# EAGLE design RS422 (EAGLE 5.05)
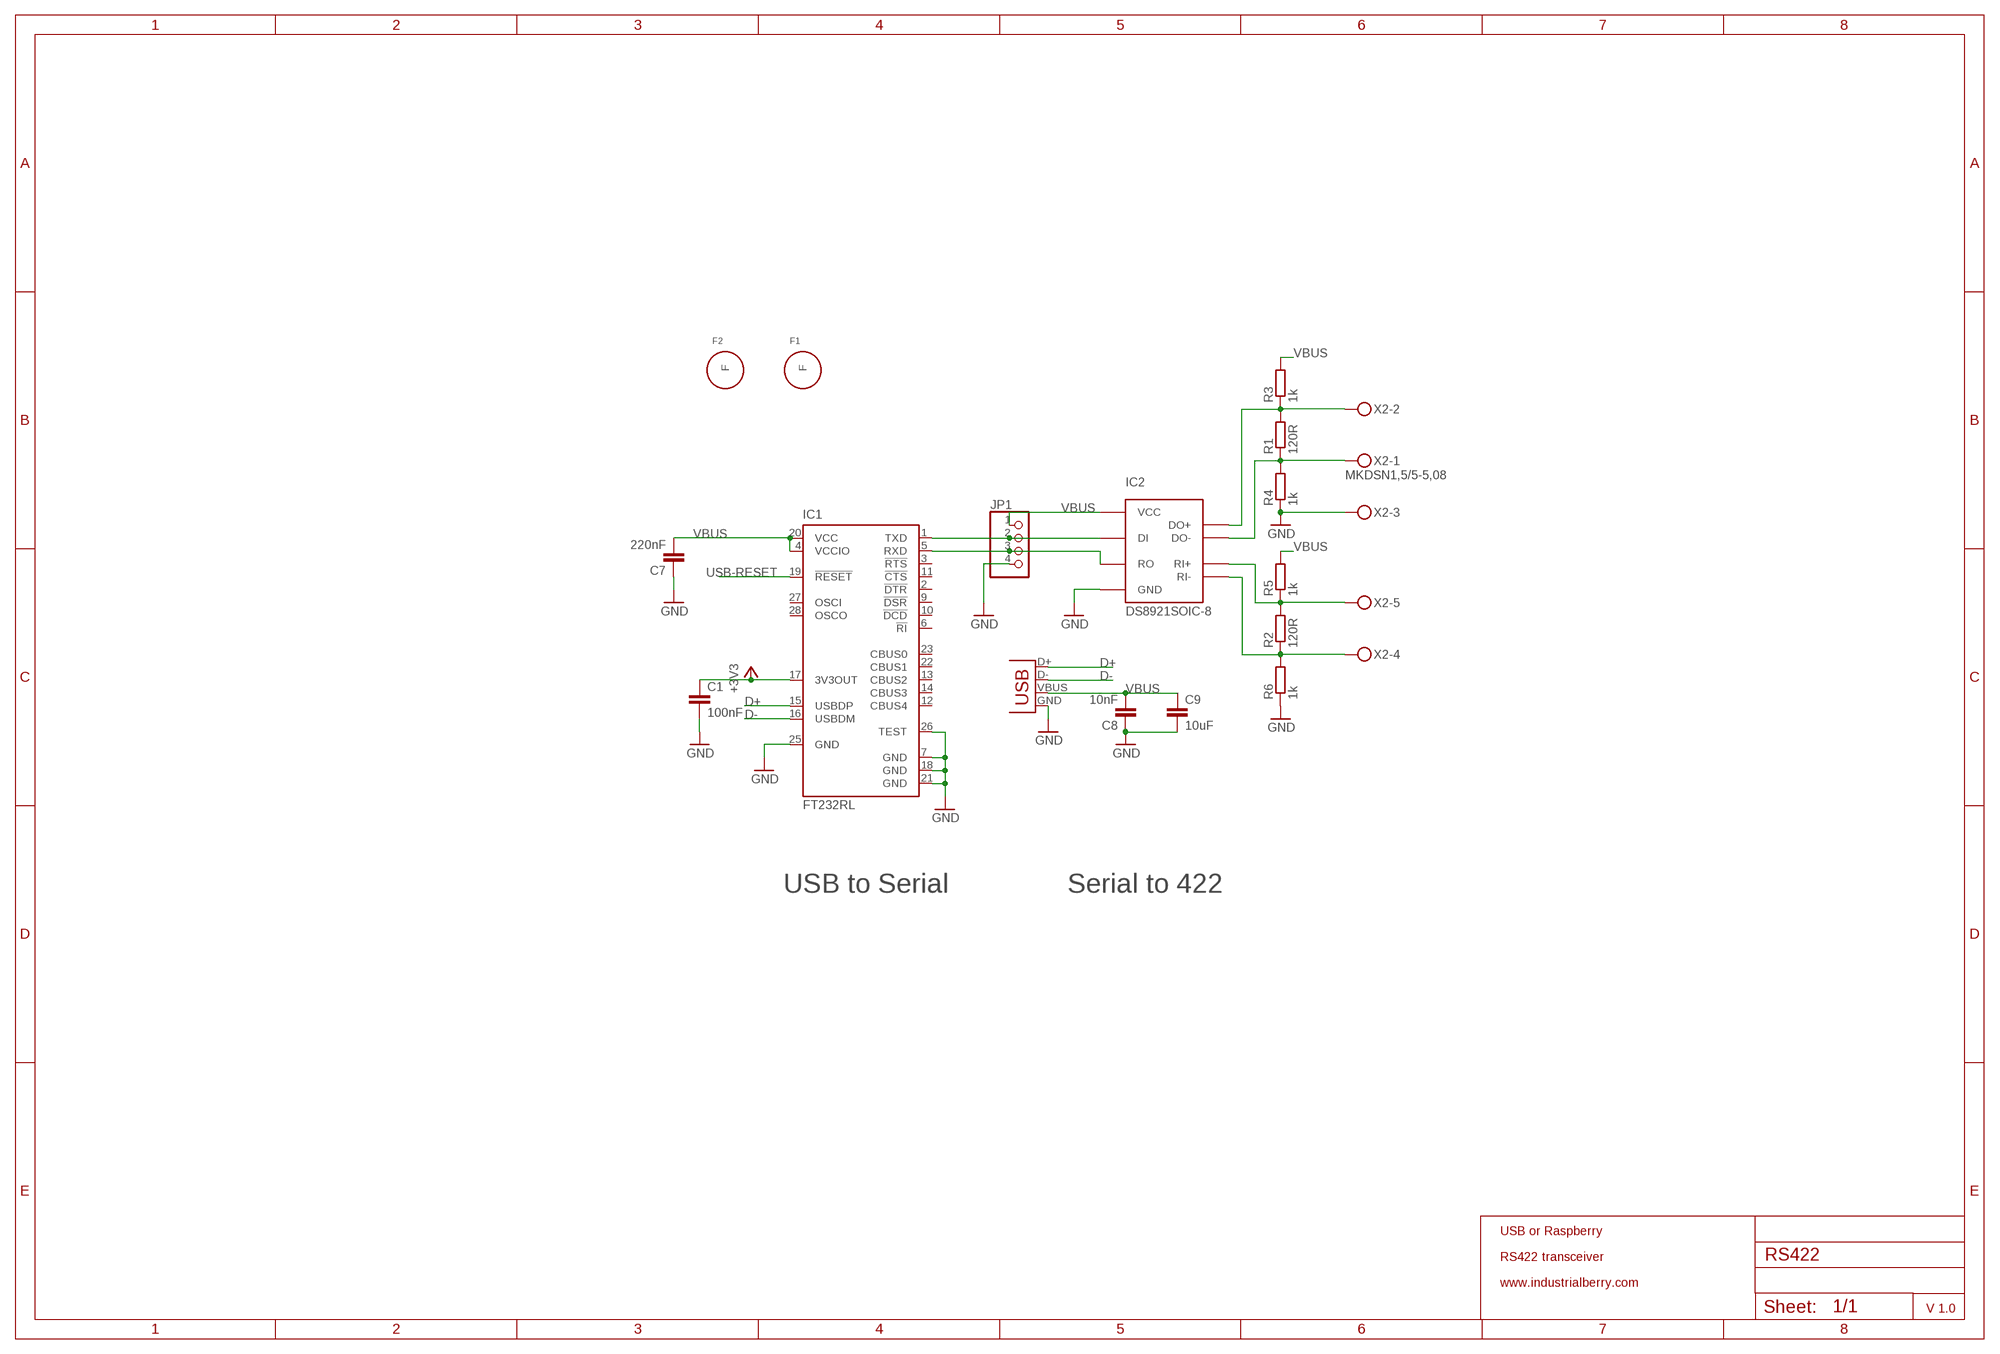
[diagram p0: schematic, sheet 1]

## Parts
C1  100nF  C-EUC0603  [C0603]
C7  220nF  C-EUC0603  [C0603]
C8  10nF  C-EUC0603  [C0603]
C9  10uF  C-EUC1206  [C1206]
F1  FIDUCIAL  [FIDUCIAL]
F2  FIDUCIAL  [FIDUCIAL]
IC1  FT232RL  [SSOP28]
IC2  DS8921SOIC-8  [SO8]
JP1  PINHD-1X4  [1X04]
R1  120R  R-EU_R1206  [R1206]
R2  120R  R-EU_R1206  [R1206]
R3  1k  R-EU_R1206  [R1206]
R4  1k  R-EU_R1206  [R1206]
R5  1k  R-EU_R1206  [R1206]
R6  1k  R-EU_R1206  [R1206]
X1  USBSMD  [USB-MINIB]
X2  MKDSN1,5/5-5,08  [MKDSN1,5/5-5,08]

## Nets
+3V3: C1.1 IC1.17(3V3OUT)
D+: IC1.15(USBDP) X1.D+
D-: IC1.16(USBDM) X1.D-
DO+: IC2.6(DO+) R1.2 R3.1 X2.2
DO-: IC2.5(DO-) R1.1 R4.2 X2.1
GND: C1.2 C7.1 C8.1 C9.2 IC1.7(GND) IC1.18(GND) IC1.21(GND) IC1.25(GND) IC1.26(TEST) IC2.4(GND) JP1.4 R4.1 R6.1 X1.GND X2.3
N$1: IC1.1(TXD) IC2.3(DI) JP1.2
N$3: IC1.5(RXD) IC2.2(RO) JP1.3
RI+: IC2.8(RI+) R2.2 R5.1 X2.5
RI-: IC2.7(RI-) R2.1 R6.2 X2.4
USB-RESET: IC1.19(!RESET)
VBUS: C7.2 C8.2 C9.1 IC1.4(VCCIO) IC1.20(VCC) IC2.1(VCC) JP1.1 R3.2 R5.2 X1.VBUS
Unconnected: F1.P$1(F) F2.P$1(F) IC1.2(!DTR) IC1.3(!RTS) IC1.6(!RI) IC1.9(!DSR) IC1.10(!DCD) IC1.11(!CTS) IC1.12(CBUS4) IC1.13(CBUS2) IC1.14(CBUS3) IC1.22(CBUS1) IC1.23(CBUS0) IC1.27(OSCI) IC1.28(OSCO)

## Notes on the sheet
- USB to Serial | Serial to 422
- USB or Raspberry
- RS422 transceiver
- www.industrialberry.com
- V 1.0

## Library data of the parts
C1 C7-C9 = rcl:C-EU: CAPACITOR, European symbol
F1 F2 = PierpaoloSmartSpaceSolutions:FIDUCIAL
IC1 = ftdichip:FT232R: Source: http://www.ftdichip.com/Documents/DataSheets/DS_FT232R_v104.pdf
IC2 = PierpaoloSmartSpaceSolutions:DS8921
JP1 = pinhead:PINHD-1X4: PIN HEADER
R1-R6 = rcl:R-EU_: RESISTOR, European symbol
X1 = SparkFun:USB: USB Connectors USB-B-PTH is fully proven SKU : PRT-00139 USB-miniB is fully proven SKU : PRT-00587 USB-A-PCB is untested. USB-A-H is throughly reviewed, but untested. Spark Fun Electronics SKU : PRT-00437 USB-B-SMT is throughly reviewed, but untested. Needs silkscreen touching up. USB-A-S has not been used/tested USB-MB-H has not been used/tested
X2 = con-phoenix-508:MKDSN1,5/5-5,08: MKDSN 1,5/ 5-5,08 Printklemme Nennstrom: 13,5 A Nennspannung: 250 V Rastermaß: 5,08 mm Polzahl: 5 Anschlussart: Schraubanschluss Montage: Löten Anschlussrichtung Leiter/Platine: 0 ° Artikelnummer: 1729157 Source: http://eshop.phoenixcontact.com .. 1729157.pdf

## Board
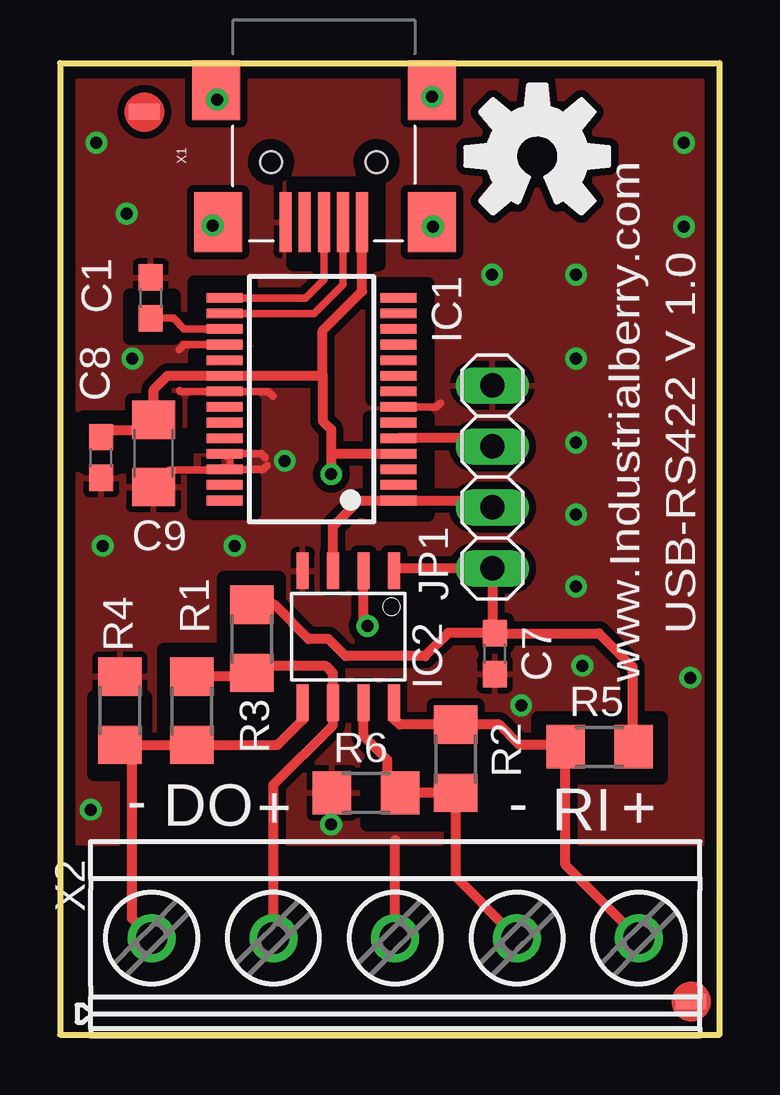
[diagram p1: board, top side]
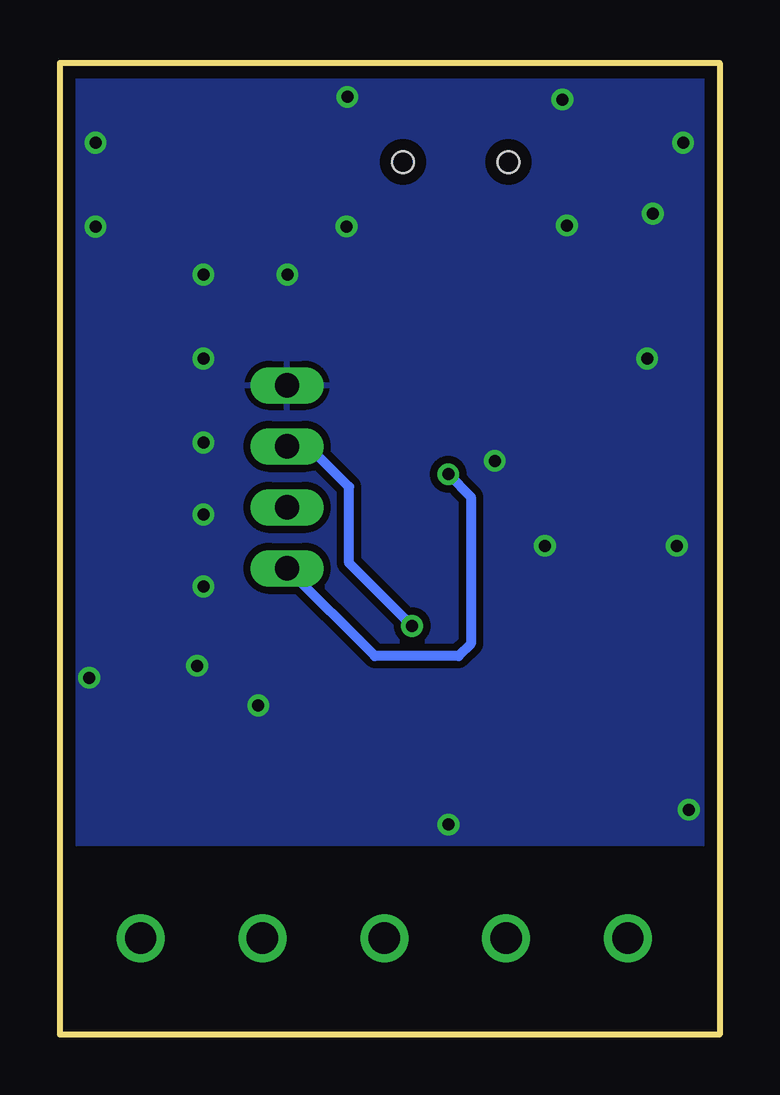
[diagram p2: board, bottom side, seen from below]

Size 27.5 x 40.5 mm. Coordinates in mm from the lower left corner, seen from the top.
Outline: 0,40.5 0,0 27.5,0 27.5,40.5 0,40.5
Copper layers (1*16): Top 0.035mm / dielectric 1.5mm / Bottom 0.035mm
Design rules "default *": minimum track width 10mil, minimum drill 24mil, track to track 8mil, track to pad 8mil, pad to pad 8mil, via to via 8mil, smd to smd 8mil, copper to edge 20mil, drill to drill 8mil, minimum pad ring 10mil, minimum via ring 8mil, stop-mask expansion 4mil, vias tented up to drill 20mil, thermal gap 10mil
tRestrict: area 5.6,29 to 7.9,31.4; area 5.6,27.1 to 8.1,28.4; area 5.6,24.5 to 8.1,26.4; area 5.6,21.8 to 8.1,23.2; area 13,26.5 to 15.3,31.3; area 12.9,21.7 to 15.3,25.7; area 9.7,32.1 to 13.3,35.5; area 2.9,29 to 4.7,30.8; area 4.3,11.2 to 6.5,16; area 6.8,14.1 to 9.1,19; area 1.4,10.9 to 3.6,14.1; area 12.8,8.8 to 16.1,11.2; 3 more areas

### Footprints (pad centres in the part's own frame; a part is rotated, then mirrored left to right if it is on the bottom)
C0603 = smd 1.1 x 1: 1 -0.85,0; 2 0.85,0
C1206 = smd 1.6 x 1.8: 1 -1.4,0; 2 1.4,0
FIDUCIAL = smd 1.27 x 0.635: P$1 0,0
SSOP28 = smd 0.4 x 1.5: 1 -4.225,-3.625; 2 -3.575,-3.625; 3 -2.925,-3.625; 4 -2.275,-3.625; 5 -1.625,-3.625; 6 -0.975,-3.625; 7 -0.325,-3.625; 8 0.325,-3.625; 9 0.975,-3.625; 10 1.625,-3.625; 11 2.275,-3.625; 12 2.925,-3.625; 13 3.575,-3.625; 14 4.225,-3.625; 15 4.225,3.625; 16 3.575,3.625; 17 2.925,3.625; 18 2.275,3.625; 19 1.625,3.625; 20 0.975,3.625; 21 0.325,3.625; 22 -0.325,3.625; 23 -0.975,3.625; 24 -1.625,3.625; 25 -2.275,3.625; 26 -2.925,3.625; 27 -3.575,3.625; 28 -4.225,3.625
SO8 = smd 0.5 x 1.524: 1 -1.905,-2.743; 2 -0.635,-2.743; 3 0.635,-2.743; 4 1.905,-2.743; 5 1.905,2.743; 6 0.635,2.743; 7 -0.635,2.743; 8 -1.905,2.743
1X04 = drill 1.016 long: 1 -3.81,0; 2 -1.27,0; 3 1.27,0; 4 3.81,0
R1206 = smd 1.6 x 1.803: 1 -1.422,0; 2 1.422,0
USB-MINIB = smd 2.5 x 0.5: D+ 2.5,0; D- 2.5,0.8; GND 2.5,-1.6; ID 2.5,-0.8; VBUS 2.5,1.6 | smd 2.5 x 2: P$1 -3,-4.5; P$2 -3,4.5; P$3 2.5,-4.4; P$4 2.5,4.5 | hole 0.9: 0,2.2; 0,-2.2
MKDSN1,5/5-5,08 = drill 1.3 pad 2 round: 1 -10.181,0.025; 2 -5.101,0.025; 3 -0.021,0.025; 4 5.059,0.025; 5 10.139,0.025

### Placement (x,y rotation side)
C1  3.79,30.71 90 top
C7  18.13,15.88 90 top
C8  1.72,24.06 90 top
C9  3.91,24.23 270 top
F1  3.52,38.46 0 top
F2  26.32,1.38 0 top
IC1  10.49,26.49 90 top
IC2  12.02,16.59 180 top
JP1  18.03,23.25 90 top
R1  5.5,13.5 90 top
R2  16.5,11.5 90 top
R3  8,16.5 90 top
R4  2.5,13.5 270 top
R5  22.5,12 0 top
R6  12.76,10.08 0 top
X1  11,36.38 270 top
X2  14,4 0 top

### Tracks (layer width: path | path; a pad name or v marks a point on that pad's centre or on a via)
+3V3
  Top 0.305: C1.1 3.73,29.8 | IC1.17 5.17,29.41 4.73,29.86 C1.1 | C1.1
D+
  Top 0.305: X1.D+ 11,31.48 10.23,30.71 IC1.15
D-
  Top 0.305: X1.D- 11.8,31.27 10.59,30.06 IC1.16
DO+
  Top 0.406: R1.2 8,14.92 R3.1 8.28,15.36 11.09,15.36 11.38,15.06 IC2.6 11.38,12.89 8.89,10.41 8.9,10.4 X2.2
DO-
  Top 0.406: IC2.5 10.12,13.12 9.08,12.08 R1.1 3,12.08 | 3,12.08 R4.2 | X2.1 3,4.84 3,12.08
GND  (via drill 0.5)
  Top 0.305: IC1.7 15.71,26.16 15.86,26.32 | IC1.18 5.18,28.77 4.97,28.55 | 4.98,26.85 5.01,26.82 IC1.21 8.69,26.82 8.89,26.61 | IC1.25 8.38,24.21 8.55,24.05 | IC1.26 8.47,23.57 8.64,23.73 | 4.56,23.16 4.56,23.53 7.1,23.53 7.1,24.17
  Top 0.406: 7.1,24.17 6.91,24.17 IC1.25 | X2.3 13.98,8.1 14,8.1
  other vias: 9.37,23.92 7.28,20.38 15.52,39.09 15.55,33.69 6.36,33.73 6.55,38.98 2.78,34.22 3.02,28.18 26.02,33.68 19.23,13.72 26.02,37.18 18.02,31.68 1.52,37.18 11.3,8.76 21.52,31.68 21.52,28.18 21.52,24.68 21.52,21.68 21.52,18.68 1.78,20.38 1.28,9.38 21.78,15.38 26.28,14.88
  pour Top (isolate 0.305): 0.1,8 0.1,40.8 27.7,40.8 27.7,8
  pour Bottom (isolate 0.305): 0.1,8 0.1,40.8 27.7,40.8 27.7,8
N$1
  Top 0.406: IC2.3 11.38,21.18 12.47,22.27 IC1.1 17.75,22.27 JP1.2
N$3  (via drill 0.5)
  Top 0.406: IC1.5 17.68,24.86 JP1.3 | IC2.2 12.65,17.2 v12.82,17.04
  Bottom 0.406: v12.82,17.04 15.44,19.66 15.44,22.83 17.13,24.52 JP1.3
N$13
  Top 0.2: 20.69,34.7 arc10 20.99,34.86 21.75,34.25 22.26,34.76 21.65,35.52 arc19 21.91,36.15 22.88,36.24 22.88,36.98 21.91,37.07 arc19 21.65,37.7 22.26,38.46 21.75,38.97 20.99,38.36 arc19 20.36,38.62 20.27,39.59 19.53,39.59 19.44,38.62 arc19 18.81,38.36 18.05,38.97 17.54,38.46 18.15,37.7 arc19 17.89,37.07 16.92,36.98 16.92,36.24 17.89,36.15 arc19 18.15,35.52 17.54,34.76 18.05,34.25 18.81,34.86 arc10 19.11,34.7 19.54,35.74 arc-67 18.96,36.61 arc-247 20.26,35.74 20.69,34.7
RI+
  Top 0.406: IC2.8 13.93,13.16 14.17,12.92 R2.2 18.32,12.92 19.16,12.08 21,12.08 R5.1 21.08,7.09 X2.5
RI-
  Top 0.406: IC2.7 12.65,12.46 13.65,11.46 13.65,10.61 R6.2 R2.1 16.5,6.58 X2.4
VBUS  (via drill 0.5)
  Top 0.406: IC2.1 14.03,19.44 JP1.1 18.03,16.83 C7.2 | X1.VBUS 12.6,30.99 10.96,29.34 10.96,27.49 | C8.2 2.01,25.2 3.31,25.2 3.74,25.63 C9.1 3.91,26.89 4.49,27.46 IC1.20 10.96,27.46 10.96,27.49 | 10.96,27.49 10.96,25.59 11.31,25.23 11.31,24.27 | 11.31,24.27 v11.31,23.36 | IC1.4 11.37,24.21 11.31,24.27 | C7.2 22.47,16.73 23.87,15.33 23.87,12.05 R5.2 | R3.2 8.94,17.92 10.37,16.49 11.2,16.49 11.91,15.78 15.22,15.78 16.19,16.75 18.11,16.75 C7.2
  Bottom 0.406: JP1.1 14.37,15.78 10.88,15.78 10.37,16.29 10.37,22.42 v11.31,23.36

### Text on the board
tPlace: USB-RS422 V 1.0 | www.Industrialberry.com | - | DO | + | - | RI | +